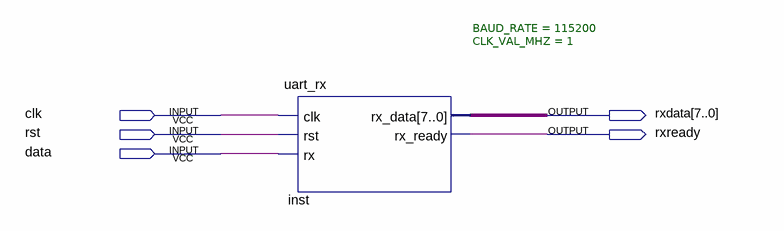
[diagram p0: schematic sheet]
// Quartus schematic uart_rx_test.bdf as structural Verilog: 1 symbols, 5 pins
module uart_rx_test (
  input  clk,
  input  rst,
  input  data,
  output [7:0] rxdata,
  output rxready
);

  uart_rx #(.BAUD_RATE(115200), .CLK_VAL_MHZ(1)) inst (
    .clk(clk), .rst(rst), .rx(data), .rx_data(rxdata), .rx_ready(rxready));
endmodule
